# EAGLE design Croduino Nova (EAGLE 7.5.0)
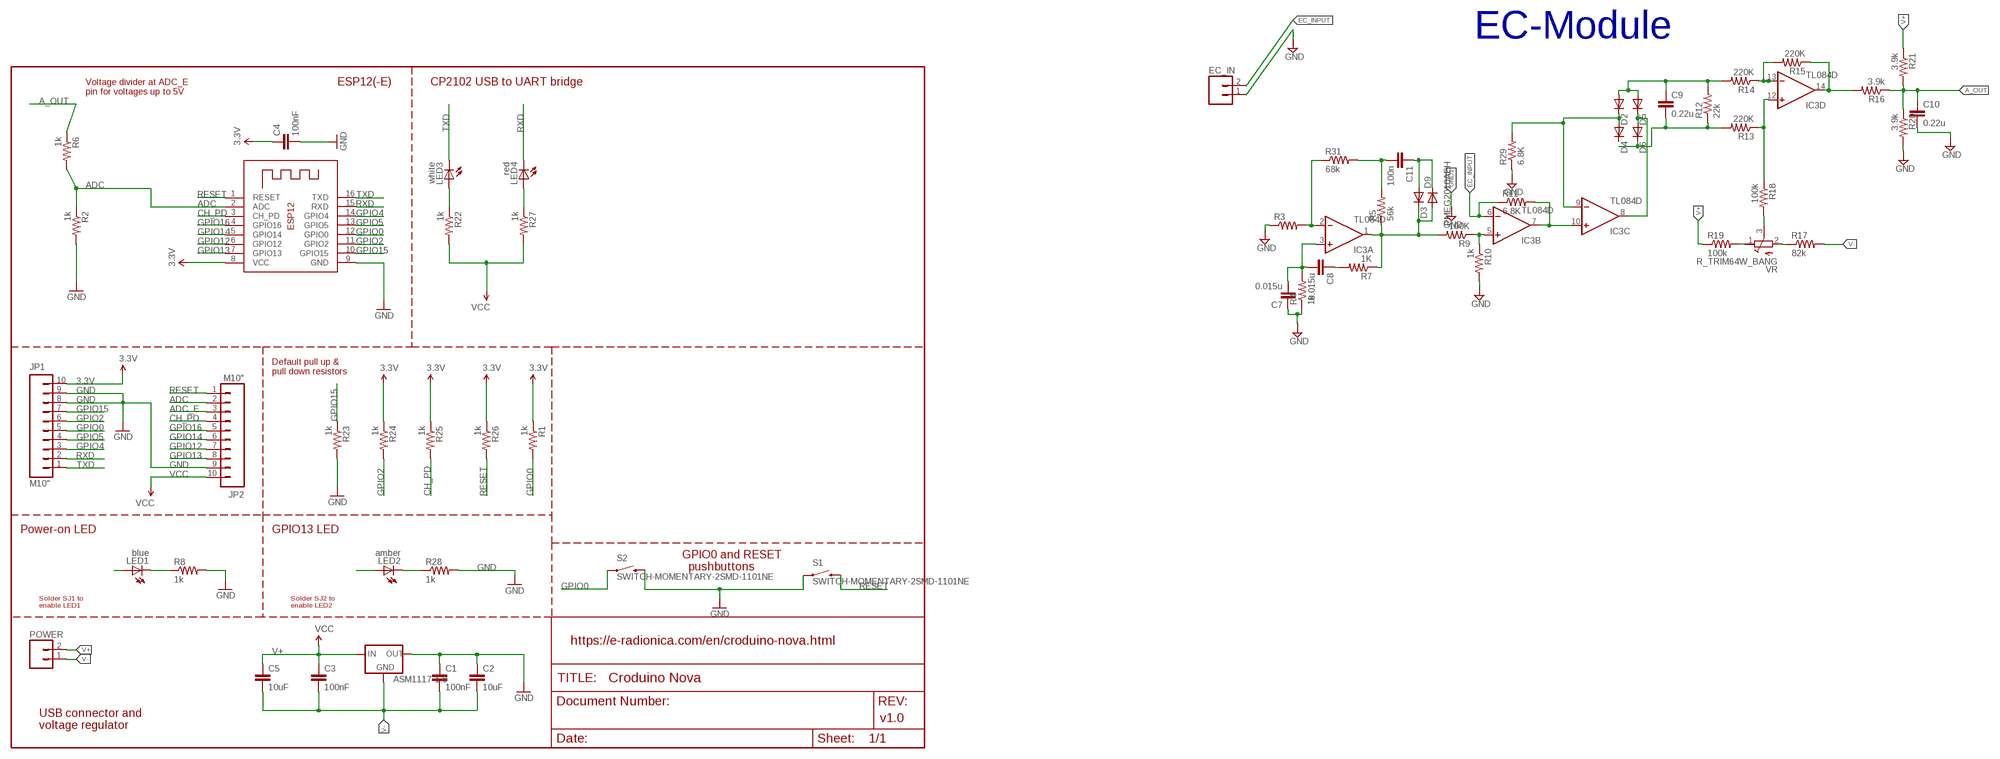
[diagram p0: schematic, sheet 1]

## Parts
ASM1117-1.8  AMS1117-3.3  [SOT223]
C1  100nF  CAP0603-CAP  [0603-CAP]
C2  10uF  CAP1206  [1206]
C3  100nF  CAP0603-CAP  [0603-CAP]
C4  100nF  CAP0603-CAP  [0603-CAP]
C5  10uF  CAP1206  [1206]
C7  0.015u  C-EUC0603  [C0603]
C8  0.015u  C-EUC0603  [C0603]
C9  0.22u  C-EUC0603  [C0603]
C10  0.22u  C-EUC0603  [C0603]
C11  100n  C-EUC0603  [C0603]
D2  PMEG2010AEH  DIOD_SOT123F  [SOT123F]
D3  PMEG2010AEH  DIOD_SOT123F  [SOT123F]
D4  PMEG2010AEH  DIOD_SOT123F  [SOT123F]
D5  PMEG2010AEH  DIOD_SOT123F  [SOT123F]
D6  PMEG2010AEH  DIOD_SOT123F  [SOT123F]
D9  PMEG2010AEH  DIOD_SOT123F  [SOT123F]
EC_IN  M025MM  [SCREWTERMINAL-5MM-2]
IC3  TL084D  [SO14]
JP1  M10"  [1X10]
JP2  M10"  [1X10]
LED1  blue  LEDCHIP-LED0603  [CHIP-LED0603]
LED2  amber  LEDCHIPLED_0603  [CHIPLED_0603]
LED3  white  LEDCHIP-LED0805  [CHIP-LED0805]
LED4  red  LEDCHIP-LED0805  [CHIP-LED0805]
POWER  M02LOCK_LONGPADS  [1X02_LOCK_LONGPADS]
R1  1k  R-US_R0603  [R0603]
R2  1k  R-US_R0603  [R0603]
R3  R-US_R0603  [R0603]
R4  1k  R-US_R0603  [R0603]
R5  56k  R-US_R0603  [R0603]
R6  1k  R-US_R0603  [R0603]
R7  1K  R-US_R0603  [R0603]
R8  1k  R-US_R0603  [R0603]
R9  100K  R-US_R0603  [R0603]
R10  1k  R-US_R0603  [R0603]
R11  6.8K  R-US_R0603  [R0603]
R12  22k  R-US_R0603  [R0603]
R13  220K  R-US_R0603  [R0603]
R14  220K  R-US_R0603  [R0603]
R15  220K  R-US_R0603  [R0603]
R16  3.9k  R-US_R0603  [R0603]
R17  82k  R-US_R0603  [R0603]
R18  100k  R-US_R0603  [R0603]
R19  100k  R-US_R0603  [R0603]
R20  3.9k  R-US_R0603  [R0603]
R21  3.9k  R-US_R0603  [R0603]
R22  1k  R-US_R0603  [R0603]
R23  1k  R-US_R0603  [R0603]
R24  1k  R-US_R0603  [R0603]
R25  1k  R-US_R0603  [R0603]
R26  1k  R-US_R0603  [R0603]
R27  1k  R-US_R0603  [R0603]
R28  1k  R-US_R0603  [R0603]
R29  6.8K  R-US_R0603  [R0603]
R31  68k  R-US_R0603  [R0603]
S1  SWITCH-MOMENTARY-2SMD-1101NE  [TACTILE-SWITCH-1101NE]
S2  SWITCH-MOMENTARY-2SMD-1101NE  [TACTILE-SWITCH-1101NE]
VR  R_TRIM64W_BANG  [RTRIM64W_BANG]
X1  ESP8266-12  ESP-12  [ESP-12]

## Nets
3.3V: C4.1 JP1.10 LED1.A R1.1 R24.1 R25.1 R26.1 X1.8(VCC)
A_OUT: C10.1 R6.1 R16.1 R20.1 R21.2
ADC: JP2.2 R2.1 R6.2 X1.2(ADC)
ADC_E: JP2.3
CH_PD: JP2.4 R25.2 X1.3(CH_PD)
EC_INPUT: EC_IN.2 IC3.6(B:-IN) R11.1
GND: ASM1117-1.8.4(OUT) C1.1 C2.1 C4.2 C7.1 C10.2 EC_IN.1 JP1.8 JP1.9 JP2.9 R2.2 R3.1 R4.1 R8.2 R10.2 R23.2 R28.2 R29.1 S1.1 S2.2 X1.9(GND)
GND1: R20.2 ; supply symbol labelled GND
GPIO0: JP1.5 R1.2 S2.1 X1.12(GPIO0)
GPIO2: JP1.6 R24.2 X1.11(GPIO2)
GPIO4: JP1.3 X1.14(GPIO4)
GPIO5: JP1.4 X1.13(GPIO5)
GPIO12: JP2.7 X1.6(GPIO12)
GPIO13: JP2.8 LED2.A X1.7(GPIO13)
GPIO14: JP2.6 X1.5(GPIO14)
GPIO15: JP1.7 R23.1 X1.10(GPIO15)
GPIO16: JP2.5 X1.4(GPIO16)
N$1: LED3.A R22.1
N$3: LED1.C R8.1
N$4: LED4.A R27.1
N$5: IC3.2(A:-IN) R3.2 R31.1
N$7: LED2.C R28.1
N$9: C7.2 C8.2 IC3.3(A:+IN) R4.2
N$10: C11.2 R5.2 R31.2
N$12: D3.C D9.A IC3.1(A:OUT) R5.1 R7.1 R9.2
N$13: C8.1 R7.2
N$14: IC3.5(B:+IN) R9.1 R10.1
N$15: IC3.7(B:OUT) IC3.10(C:+IN) R11.2
N$16: C9.1 D2.A D5.A R12.2 R14.2
N$17: D2.C D4.A IC3.9(C:-IN) R29.2
N$18: C9.2 D6.C R12.1 R13.2
N$19: D5.C D6.A IC3.8(C:OUT)
N$20: IC3.13(D:-IN) R14.1 R15.2
N$21: IC3.12(D:+IN) R13.1 R18.1
N$22: IC3.14(D:OUT) R15.1 R16.2
N$23: C11.1 D3.A D9.C
N$24: R17.1 VR.2(E)
N$25: R19.2 VR.1(A)
N$26: R18.2 VR.3(S)
RESET: JP2.1 R26.2 S1.2 X1.1(RESET)
RXD: JP1.2 LED4.C X1.15(RXD)
TXD: JP1.1 LED3.C X1.16(TXD)
V+: ASM1117-1.8.3(IN) C3.1 C5.1 POWER.2 R19.1 R21.1 ; supply symbol labelled VCC
V-: ASM1117-1.8.1(ADJ) C1.2 C2.2 C3.2 C5.2 POWER.1 R17.2
VCC: JP2.10 R22.2 R27.2
Unconnected: D4.C

## Notes on the sheet
- EC-Module
- ESP12(-E) | CP2102 USB to UART bridge
- Voltage divider at ADC_E
  pin for voltages up to 5V
- Default pull up &
  pull down resistors
- Power-on LED | GPIO13 LED
- GPIO0 and RESET
    pushbuttons
- Solder SJ1 to 
  enable LED1
- Solder SJ2 to
  enable LED2
- https://e-radionica.com/en/croduino-nova.html
- v1.0
- USB connector and 
  voltage regulator

## Power pins joined to a net without a drawn wire
V+: IC3.4(P:V+)
V-: IC3.11(P:V-)

## Library data of the parts
ASM1117-1.8 = SparkFun:AMS1117-3.3
C1-C5 = SparkFun:CAP: Capacitor Standard 0603 ceramic capacitor, and 0.1" leaded capacitor.
C7-C11 = resistor:C-EU: CAPACITOR, European symbol
D2-D6 D9 = Enleka_Diode:DIOD_SOT123F; PARTNO: PMEG2010AEH,115
EC_IN = SparkFun-Connectors:M02: Standard 2-pin 0.1" header. Use with - straight break away headers ( PRT-00116) - right angle break away headers (PRT-00553) - swiss pins (PRT-00743) - machine pins (PRT-00117) - female headers (PRT-00115) Molex polarized connector foot print use with: PRT-08233 with associated crimp pins and housings. 2.54_SCREWTERM for use with PRT-10571. 3.5mm Screw Terminal footprints for PRT-08084 5mm Screw Terminal footprints for use with PRT-08432; STOREFRONT_ID: PRT-08432
IC3 = linear:TL084: OP AMP
JP1 JP2 = SparkFun:M10: Header 10 Standard 10-pin 0.1" header. Use with straight break away headers (SKU : PRT-00116), right angle break away headers (PRT-00553), swiss pins (PRT-00743), machine pins (PRT-00117), and female headers (PRT-00115).
LED1-LED4 = adafruit:LED: LED OSRAM: - CHIPLED LG R971, LG N971, LY N971, LG Q971, LY Q971, LO R971, LY R971 LH N974, LH R974 LS Q976, LO Q976, LY Q976 LO Q996 - Hyper CHIPLED LW Q18S LB Q993, LB Q99A, LB R99A - SideLED LS A670, LO A670, LY A670, LG A670, LP A670 LB A673, LV A673, LT A673, LW A673 LH A674 LY A675 LS A676, LA A676, LO A676, LY A676, LW A676 LS A679, LY A679, LG A679 - Hyper Micro SIDELED® LS Y876, LA Y876, LO Y876, LY Y876 LT Y87S - SmartLED LW L88C, LW L88S LB L89C, LB L89S, LG L890 LS L89K, LO L89K, LY L89K LS L896, LA L896, LO L896, LY L896 - TOPLED LS T670, LO T670, LY T670, LG T670, LP T670 LSG T670, LSP T670, LSY T670, LOP T670, LYG T670 LG T671, LOG T671, LSG T671 LB T673, LV T673, LT T673, LW T673 LH T674 LS T676, LA T676, LO T676, LY T676, LB T676, LH T676, LSB T676, LW T676 LB T67C, LV T67C, LT T67C, LS T67K, LO T67K, LY T67K, LW E67C LS E67B, LA E67B, LO E67B, LY E67B, LB E67C, LV E67C, LT E67C LW T67C LS T679, LY T679, LG T679 LS T770, LO T770, LY T770, LG T770, LP T770 LB T773, LV T773, LT T773, LW T773 LH T774 LS E675, LA E675, LY E675, LS T675 LS T776, LA T776, LO T776, LY T776, LB T776 LHGB T686 LT T68C, LB T68C - Hyper Mini TOPLED® LB M676 - Mini TOPLED Santana® LG M470 LS M47K, LO M47K, LY M47K Source: http://www.osram.convergy.de/
POWER = SparkFun-Connectors:M02: Standard 2-pin 0.1" header. Use with - straight break away headers ( PRT-00116) - right angle break away headers (PRT-00553) - swiss pins (PRT-00743) - machine pins (PRT-00117) - female headers (PRT-00115) Molex polarized connector foot print use with: PRT-08233 with associated crimp pins and housings. 2.54_SCREWTERM for use with PRT-10571. 3.5mm Screw Terminal footprints for PRT-08084 5mm Screw Terminal footprints for use with PRT-08432
R1-R29 R31 = resistor:R-US_: RESISTOR, American symbol
S1 S2 = SparkFun-Electromechanical:SWITCH-MOMENTARY-2: Various NO switches- pushbuttons, reed, etc; PROD_ID: SWCH-00815
VR = rtrim:R_TRIM64W_BANG
X1 = adafruit:ESP-12

## Net classes
0 default: width 0.178 mm, drill 0.381 mm, clearance 0.178 mm

## Board
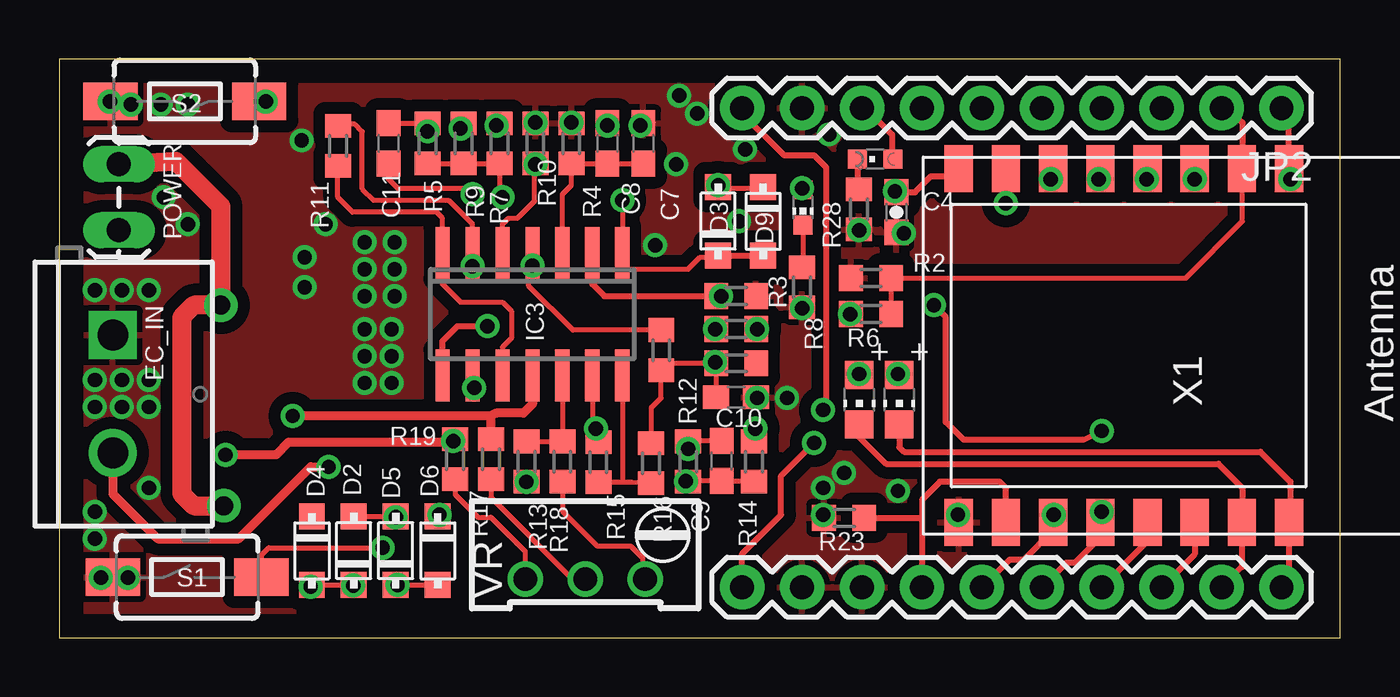
[diagram p1: board, top side]
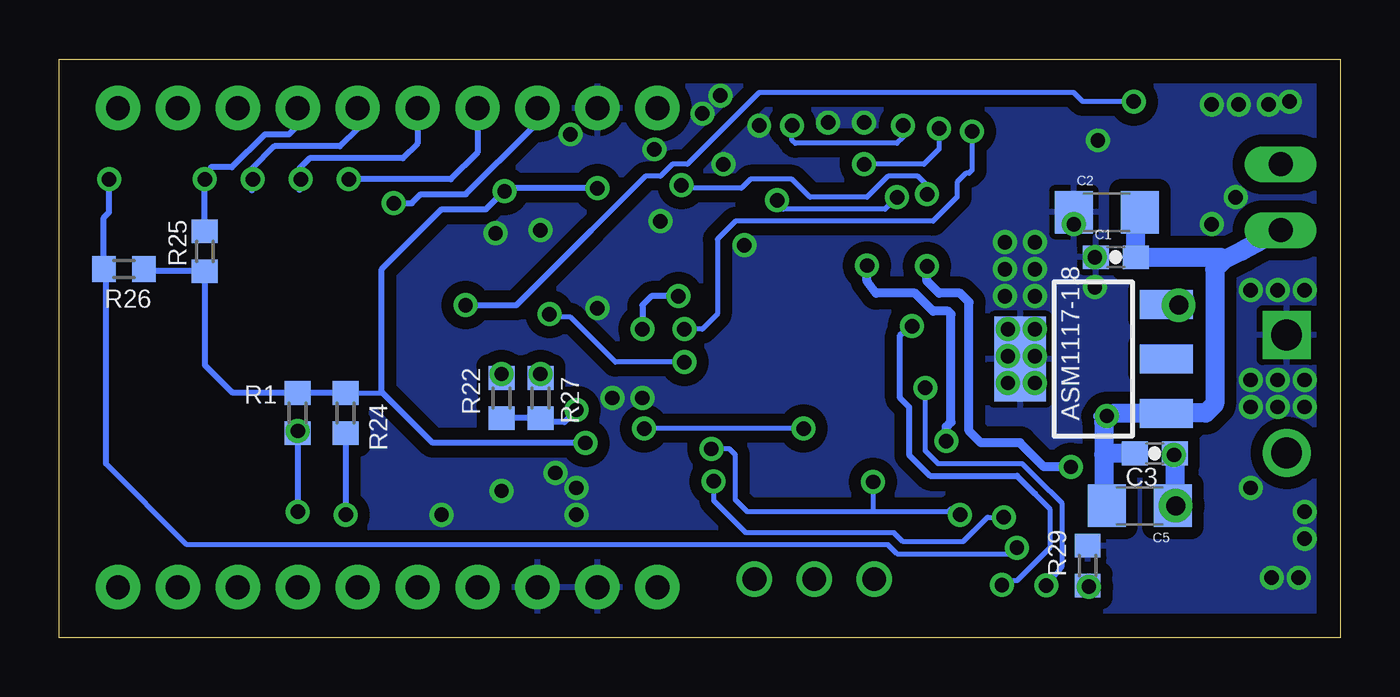
[diagram p2: board, bottom side, seen from below]

Size 54.32 x 24.54 mm. Coordinates in mm from the lower left corner, seen from the top.
Outline: 0,0 54.32,0 54.32,24.54 0,24.54 0,0
Copper layers (1*16): Top 0.035mm / dielectric 1.5mm / Bottom 0.035mm
Design rules "default *": minimum track width 8mil, minimum drill 24mil, track to track 10mil, track to pad 10mil, pad to pad 10mil, via to via 1mil, smd to smd 8mil, copper to edge 40mil, drill to drill 8mil, minimum pad ring 10mil, minimum via ring 8mil, stop-mask expansion 4mil, vias tented up to drill 5mm, thermal gap 10mil

### Footprints (pad centres in the part's own frame; a part is rotated, then mirrored left to right if it is on the bottom)
SOT223 = smd 1.219 x 2.235: 1 -2.311,-3.099; 2 0,-3.099; 3 2.311,-3.099 | smd 3.6 x 2.2: 4 0,3.099
0603-CAP = smd 1.1 x 1: 1 -0.85,0; 2 0.85,0
1206 = smd 1.6 x 1.8: 1 -1.4,0; 2 1.4,0
C0603 = smd 1.1 x 1: 1 -0.85,0; 2 0.85,0
SOT123F = smd 1.1 x 1.1: A 1.45,0; C -1.45,0
SCREWTERMINAL-5MM-2 = drill 1.3 pad 2.032 square: 1 0,0 | drill 1.3 pad 2.032: 2 5,0
SO14 = smd 0.6 x 2.2: 1 -3.81,-2.6; 2 -2.54,-2.6; 3 -1.27,-2.6; 4 0,-2.6; 5 1.27,-2.6; 6 2.54,-2.6; 7 3.81,-2.6; 8 3.81,2.6; 9 2.54,2.6; 10 1.27,2.6; 11 0,2.6; 12 -1.27,2.6; 13 -2.54,2.6; 14 -3.81,2.6
1X10 = drill 1.016 pad 1.88: 1 0,0; 2 2.54,0; 3 5.08,0; 4 7.62,0; 5 10.16,0; 6 12.7,0; 7 15.24,0; 8 17.78,0; 9 20.32,0; 10 22.86,0
CHIP-LED0603 = smd 0.8 x 0.8: A 0,-0.75; C 0,0.75
CHIPLED_0603 = smd 0.8 x 0.8: A 0,-0.75; C 0,0.75
CHIP-LED0805 = smd 1.2 x 1.2: A 0,-1.05; C 0,1.05
1X02_LOCK_LONGPADS = drill 1.016 long: 1 -0.127,0; 2 2.667,0
R0603 = smd 1 x 1.1: 1 -0.85,0; 2 0.85,0
TACTILE-SWITCH-1101NE = smd 2.3 x 1.6: 1 -3.15,0; 2 3.15,0
RTRIM64W_BANG = drill 1: 1 2.54,-2.54; 2 2.54,0; 3 2.54,2.54
ESP-12 = smd 2 x 1.2: 1 -7.5,4.5; 2 -7.5,2.5; 3 -7.5,0.5; 4 -7.5,-1.5; 5 -7.5,-3.5; 6 -7.5,-5.5; 7 -7.5,-7.5; 8 -7.5,-9.5; 9 7.5,-9.5; 10 7.5,-7.5; 11 7.5,-5.5; 12 7.5,-3.5; 13 7.5,-1.5; 14 7.5,0.5; 15 7.5,2.5; 16 7.5,4.5

### Placement (x,y rotation side)
ASM1117-1.8  10.48,11.81 90 bottom
C1  9.52,16.13 0 bottom
C2  9.91,18.03 0 bottom
C3  7.87,7.81 180 bottom
C4  35.5,18.03 270 top
C5  8.51,5.59 180 bottom
C7  24.77,20.96 270 top
C8  23.24,20.96 270 top
C9  28.09,7.49 90 top
C10  28.7,10.19 0 top
C11  13.97,20.96 90 top
D2  12.5,3.68 90 top
D3  27.94,17.65 90 top
D4  10.72,3.68 270 top
D5  14.27,3.68 90 top
D6  16.05,3.68 270 top
D9  29.84,17.65 270 top
EC_IN  2.29,12.83 270 top
IC3  20.07,13.72 180 top
JP1  51.82,2.13 180 top
JP2  51.82,22.46 180 top
LED1  31.53,18.24 180 top
LED2  34.59,20.29 90 top
LED3  35.61,10.09 180 top
LED4  33.92,10.09 180 top
POWER  2.54,17.4 90 top
R1  44.2,9.53 270 bottom
R2  34.42,15.24 180 top
R3  28.7,14.48 180 top
R4  21.72,20.96 270 top
R5  15.62,20.96 90 top
R6  34.42,13.72 0 top
R7  18.67,20.96 90 top
R8  31.5,14.86 270 top
R9  17.14,20.96 270 top
R10  20.19,20.96 90 top
R11  11.84,20.85 270 top
R12  26.67,7.47 270 top
R13  19.81,7.47 270 top
R14  29.46,7.47 270 top
R15  22.86,7.44 90 top
R16  25.1,7.39 270 top
R17  18.31,7.57 90 top
R18  21.34,7.47 270 top
R19  16.79,7.57 270 top
R20  28.7,11.63 0 top
R21  25.53,12.19 270 top
R22  35.56,10.16 270 bottom
R23  33.27,5.08 180 top
R24  42.16,9.53 270 bottom
R25  48.13,16.38 90 bottom
R26  51.56,15.62 180 bottom
R27  33.91,10.16 270 bottom
R28  33.91,18.16 270 top
R29  10.72,3.05 270 bottom
R31  28.7,13.08 180 top
S1  5.44,2.57 0 top
S2  5.33,22.73 180 top
U$2  [CRODUINO_NOVA]  4.32,0.64 0 top
U$3  [NOVI_LOGO-4MM]  25.74,14.76 0 top
U$4  [OSH3MM]  20.22,3.87 0 top
VR  22.3,5.03 270 top
X1  47.64,12.38 270 top

### Tracks (layer width: path | path; a pad name or v marks a point on that pad's centre or on a via)
3.3V  (via drill 0.61)
  Top 0.203: 37.9,19.65 X1.8
  Top 0.254: X1.8 37.81,19.56 36.96,19.56 36.28,18.88 C4.1 35.33,18.92 v35.43,18.92 | LED1.A 31.69,18.99 v31.5,19.05 | JP1.10 28.96,3.56 30.61,5.21 30.61,6.86 v32,8.26
  Bottom 0.203: R24.1 40.68,10.38 40.64,10.41
  Bottom 0.254: v31.5,19.05 35.05,19.05 v35.43,18.92 35.47,18.88 C4.1 36.22,18.16 38.1,18.16 40.64,15.62 40.64,10.41 38.48,8.26 v32,8.26 | R24.1 R1.1 46.95,10.38 48.13,11.56 R25.1 50.5,15.53 R26.1
A_OUT  (via drill 0.61)
  Top 0.203: R20.1 C10.1 | R16.1 25.09,9.73 25.53,10.16 R21.2 25.82,11.63 R20.1 | R20.1 28.14,11.63 v27.81,11.68 | v33.53,13.72 R6.1
  Bottom 0.203: v27.81,11.68 30.73,11.68 32.64,13.59 33.15,13.59 v33.53,13.72
ADC
  Top 0.203: R6.2 R2.1 47.75,15.24 50.16,17.65 50.16,19.85 X1.2
  Top 0.254: JP2.2 49.55,22.46 50.16,21.84 50.16,19.91 X1.2
CH_PD  (via drill 0.61)
  Top 0.254: v48.13,19.43 48.01,19.75 X1.3
  Bottom 0.254: R25.2 v48.13,19.43 47.88,19.94 46.99,19.94 45.59,21.34 44.58,21.34 44.2,21.71 JP2.4
EC_INPUT  (via drill 0.61)
  Top 0.203: 17.53,16.57 17.53,17.53 16.51,18.54 13.33,18.54 12.85,19.03 12.85,21.46 12.55,21.77 11.9,21.77 R11.1
  Top 0.381: EC_IN.2 2.29,6.1 4.19,4.19 7.62,4.19 10.67,7.24 v11.43,7.24 | v17.53,15.75 IC3.6 17.53,16.57
  Bottom 0.381: v11.43,7.24 12.57,7.24 13.59,8.26 15.24,8.26 15.75,8.76 15.75,14.22 16.13,14.61 17.02,14.61 17.53,15.11 v17.53,15.75
GND  (via drill 0.61)
  Top 0.203: R4.1 22.06,21.81 v21.72,21.84 | v24.64,21.72 25.19,21.84 C7.1
  Bottom 0.203: 24.51,21.84 v24.64,21.72
  other vias: 32.38,5.21 29.59,10.16 30.86,10.16 35.81,17.15 32.38,6.35 33.27,6.98 33.91,17.27 1.78,2.54 2.92,2.54 1.52,4.19 1.52,5.33 1.52,10.92 2.67,10.92 3.81,10.92 3.81,9.78 2.67,9.78 1.52,9.78 2.16,22.73 3.05,22.61 26.29,22.99 27.05,22.23 29.08,20.7 32.64,21.34 20.19,21.84 26.16,20.07 10.41,16.13 10.41,14.86 11.3,17.53 12.95,13.08 14.1,13.08 14.1,11.94 12.95,11.94 4.44,18.67 5.46,17.53 38.1,5.21 25.27,16.64 12.95,14.48 14.22,14.48 12.95,15.62 14.22,15.62 12.95,16.76 14.22,16.76 3.81,6.35 10.29,21.08 35.56,6.22 4.32,22.61 5.46,22.61 1.52,14.73 2.67,14.73 3.81,14.73 31.5,13.97 28.83,17.65 12.95,10.79 14.1,10.79
  pour Top (isolate 0.508): 0.13,0.64 54.31,0.64 54.31,24.12 0.13,24.12
  pour Bottom (isolate 0.508): 0.13,0.51 54.31,0.64 54.31,24.12 0.13,24.12
GPIO0  (via drill 0.61)
  Top 0.203: S2.1 v8.76,22.73
  Top 0.254: v44.2,5.33 44.2,4.94 X1.12 44.14,4.26 43.05,3.17 42.7,3.17 JP1.5 | v44.2,8.76 43.43,8.38 38.35,8.38 37.59,9.14 37.59,13.59 v37.08,14.1
  Bottom 0.203: v8.76,22.73 10.92,22.73 11.3,23.11 24.64,23.11 27.69,20.07 28.32,20.07 28.83,19.56 29.46,19.56 31.75,17.27
  Bottom 0.254: v44.2,5.33 R1.2 v44.2,8.76 | v37.08,14.1 34.92,14.1 31.75,17.27
GPIO2  (via drill 0.61)
  Top 0.254: v42.16,5.21 42.16,4.91 X1.11 42.14,4.54 40.89,3.3 40.28,3.3 JP1.6
  Bottom 0.254: R24.2 v42.16,5.21
GPIO4
  Top 0.254: X1.14 48.14,3.53 JP1.3
GPIO5
  Top 0.254: X1.13 46.14,4.07 JP1.4
GPIO12  (via drill 0.61)
  Top 0.254: v42.04,19.43 41.94,19.69 X1.6
  Bottom 0.254: JP2.7 36.58,20.57 37.72,19.43 v42.04,19.43
GPIO13  (via drill 0.61)
  Top 0.254: JP2.8 34.19,22.46 35.31,21.34 35.31,20.32 LED2.A | X1.7 v40.14,18.42 v40.13,18.42
  Bottom 0.254: v40.13,18.42 39.37,18.42 38.99,18.8 37.08,18.8 34.29,21.59 34.29,22.2 JP2.8
GPIO14  (via drill 0.61)
  Top 0.254: v44.07,19.43 44.07,19.82 X1.5
  Bottom 0.254: JP2.6 39.12,20.95 39.75,20.32 43.7,20.32 X1.5 44.14,18.99 v44.07,19.43
GPIO15
  Top 0.254: R23.1 36.58,5.08 | 36.58,5.08 JP1.7 | X1.10 40.14,6.35 39.88,6.6 37.34,6.6 36.58,5.84 36.58,5.08
GPIO16  (via drill 0.61)
  Top 0.254: v46.1,19.43 46.1,19.85 X1.4
  Bottom 0.254: JP2.5 41.66,21.59 42.42,20.83 45.19,20.83 X1.4 46.14,18.96 v46.1,19.43
N$1  (via drill 0.61)
  Top 0.203: LED3.A 35.36,11.61 v35.56,11.18
  Bottom 0.203: v35.56,11.18 35.69,11.14 R22.1
N$3
  Top 0.203: LED1.C 31.53,15.74 R8.1
N$4  (via drill 0.61)
  Top 0.203: LED4.A 33.8,11.16 v33.91,11.18
  Bottom 0.203: v33.91,11.18 R27.1
N$5  (via drill 0.61)
  Top 0.254: IC3.2 22.61,14.99 23.11,14.48 R3.2 v28.07,14.48 | v29.59,13.08 29.46,12.99 R31.1
  Bottom 0.254: v28.07,14.48 29.21,14.48 29.59,14.1 v29.59,13.08
N$7
  Top 0.254: LED2.C 33.84,19.07 R28.1
N$9
  Top 0.203: IC3.3 21.34,18.8 21.72,19.18 R4.2 C8.2 C7.2
N$10  (via drill 0.61)
  Top 0.203: C11.2 R5.2 v15.62,21.46 | v27.81,13.08 R31.2
  Bottom 0.203: v15.62,21.46 15.62,19.81 15.75,19.69 15.88,19.69 16.26,19.3 16.26,18.67 17.27,17.65 25.65,17.65 26.42,16.89 26.42,13.72 27.05,13.08 v27.81,13.08
N$12  (via drill 0.61)
  Top 0.203: R5.1 R9.2 R7.1 18.67,18.92 v18.8,18.67 | v23.88,18.54 IC3.1 23.88,15.75 24,15.62 26.67,15.62 27.18,16.13 27.87,16.13 D3.C
  Top 0.254: 27.83,16.32 D3.C D9.A
  Bottom 0.203: v18.8,18.67 19.3,18.16 23.62,18.16 v23.88,18.54
N$13  (via drill 0.61)
  Top 0.203: R7.2 18.63,21.81 v18.54,21.72 | v23.24,21.72 C8.1
  Bottom 0.203: v18.54,21.72 18.54,21.21 18.8,20.96 23.11,20.96 23.24,21.08 v23.24,21.72
N$14  (via drill 0.61)
  Top 0.203: IC3.5 18.8,17.53 19.05,17.78 19.43,17.78 20.17,18.52 20.17,20.08 R10.1 | R9.1 17.14,21.72 v17.02,21.59 | 20.19,19.94 20.61,20.19 R10.1 | v20.19,20.07 20.15,20.07 R10.1
  Bottom 0.203: v17.02,21.59 17.02,20.7 17.65,20.07 v20.19,20.07
N$15
  Top 0.203: 18.85,11.17 IC3.10 18.8,12.32 19.18,12.7 19.18,13.84 18.8,14.22 17.02,14.22 16.26,14.99 IC3.7 16.26,17.78 16,18.03 12.45,18.03 11.81,18.67 11.81,19.98 R11.2
N$16  (via drill 0.61)
  Top 0.203: R14.2 29.44,6.64 C9.1 26.7,6.64 R12.2 26.58,6.62 v26.57,6.63 | v14.28,5.1 14.3,5.1 D5.A D2.A
  Bottom 0.203: v26.57,6.63 26.57,5.82 25.2,4.45 18.92,4.45 18.54,4.06 16,4.06 14.96,5.1 v14.28,5.1
N$17  (via drill 0.61)
  Top 0.203: D2.C 12.5,2.31 v12.47,2.21 | v17.6,10.59 17.63,11.01 IC3.9 | v10.67,2.16 10.67,2.18 D4.A 12.45,2.23 v12.47,2.21 | 12.24,1.98 v12.47,2.21
  Bottom 0.203: v17.6,10.59 17.6,7.92 17.04,7.37 13.49,7.37 12.34,6.22 12.32,6.22 11.81,5.71 11.81,3 v12.47,2.21 | R29.2 10.72,2.21 v10.67,2.16
N$18  (via drill 0.61)
  Top 0.203: C9.2 26.7,8.34 R12.1 v26.67,8 | D6.C 16.05,5.38 v16.13,5.21 | R13.2 v19.81,6.6
  Bottom 0.203: v16.13,5.21 16.51,5.46 16.64,5.33 19.81,5.33 | 19.81,5.33 25.15,5.33 25.65,5.84 25.65,7.75 25.91,8 v26.67,8 | v19.81,6.6 19.81,5.33
N$19  (via drill 0.61)
  Top 0.203: D6.A v14.35,2.23 D5.C
  Top 0.254: IC3.8 16.26,12.57 16.89,13.21 v18.16,13.21
  Bottom 0.203: 12.95,6.1 12.32,5.46 12.32,3.81 13.72,2.41 14.3,2.41 v14.35,2.23
  Bottom 0.254: 12.95,6.1 13.72,6.86 17.4,6.86 18.29,7.75 18.29,9.78 18.67,10.16 18.67,12.83 v18.16,13.21
N$20  (via drill 0.61)
  Top 0.203: IC3.13 22.61,8.55 R15.2 23.05,8.29 23.11,8.36 v22.76,8.87 | v29.52,8.87 29.42,8.36 R14.1
  Bottom 0.203: v22.76,8.87 v29.52,8.87
N$21
  Top 0.203: IC3.12 R18.1 R13.1
N$22
  Top 0.203: R15.1 23.93,6.59 | 23.93,6.59 24.28,6.59 R16.2 | IC3.14 23.88,6.64 23.93,6.59
N$23  (via drill 0.61)
  Top 0.203: C11.1 13.97,19.43 14.35,19.05 17.27,19.05 v17.53,18.8 | v27.94,19.18 28.12,19.05 | 28.12,19.05 D3.A | 28.12,19.05 29.79,19.05 D9.C
  Bottom 0.203: v27.94,19.18 27.69,19.05 25.4,19.05 25.02,19.43 23.24,19.43 22.48,18.67 20.07,18.67 19.18,19.56 17.91,19.56 17.53,19.18 v17.53,18.8
N$24
  Top 0.203: VR.2 22.23,2.56 21.69,2.56 18.31,5.94 R17.1
N$25
  Top 0.203: R19.2 16.79,6.07 17.75,5.1 18.31,5.1 19.76,3.66 VR.1
N$26
  Top 0.203: R18.2 21.34,5.36 22.81,3.89 24.23,3.89 24.74,3.38 24.74,2.59 VR.3
RESET  (via drill 0.61)
  Top 0.203: S1.2 8.59,3.51 8.89,3.81 v13.72,3.81
  Top 0.254: JP2.1 52.14,22.14 X1.1 52.2,19.82 v52.2,19.43
  Bottom 0.203: 52.32,7.37 48.89,3.94 19.18,3.94 18.8,3.56 13.97,3.56 v13.72,3.81
  Bottom 0.254: 52.2,22.08 JP2.1 | 52.32,7.37 52.32,15.66 R26.2 52.41,17.82 52.2,18.03 v52.2,19.43
RXD
  Top 0.254: LED4.C 33.92,8.5 35.05,7.37 49.15,7.37 50.16,6.35 50.16,4.91 X1.15 50.14,2.99 JP1.2
TXD
  Top 0.254: LED3.C 35.61,8.07 35.81,7.87 50.93,7.87 52.2,6.6 52.2,4.94 X1.16 52.14,2.45 JP1.1
V+  (via drill 0.61, 0.81 pad 1.42)
  Top 0.203: R21.1 21.78,13.04 19.91,14.91 19.91,15.62 v20.07,15.77
  Top 0.381: v7.06,7.75 9.2,7.75 9.74,8.29 16.55,8.29 v16.71,8.33 16.79,8.53 R19.1 | v20.07,15.77 20.17,16.21 IC3.4
  Top 0.813: v6.98,5.59 5.71,5.59 5.21,6.1 5.21,13.59 5.71,14.1 v6.86,14.1 6.86,18.29 4.95,20.19 POWER.2
  Bottom 0.381: v7.06,7.75 7.09,7.75 C3.1 | v20.07,15.77 20.07,15.11 19.69,14.61 18.03,14.61 17.27,13.84 16.64,13.84 16.51,13.72 16.51,9.14 16.71,8.94 v16.71,8.33
  Bottom 0.813: ASM1117-1.8.3 6.88,14.12 v6.86,14.1 6.6,14.35 | C5.1 v6.98,5.59 7.02,5.63 C3.1
V-  (via drill 0.61)
  Top 0.203: 18.34,8.45 R17.2
  Top 0.381: IC3.11 20.07,9.91 19.69,9.53 18.54,9.53 18.29,9.4 | 18.29,9.4 18.29,8.45 R17.2 | 18.29,9.4 v9.91,9.4
  Bottom 0.381: v9.91,9.4 10.29,9.4 10.03,9.14
  Bottom 0.813: POWER.1 4.19,16.38 4.95,16 | 4.95,16 5.33,15.62 5.33,9.91 5.71,9.53 7.36,9.53 ASM1117-1.8.1 9.68,9.5 10.03,9.14 10.03,7.75 | C2.2 8.68,17.87 C1.2 5.08,16.13 4.95,16 | 10.03,7.75 10.03,5.71 C5.2 | C3.2 9.97,7.81 10.03,7.75
VCC  (via drill 0.61)
  Top 0.254: JP2.10 28.96,22.22 30.73,20.45 32,20.45 32.51,19.94 32.51,9.78 v32.38,9.65
  Bottom 0.254: R22.2 R27.2 33.74,9.14 32.89,9.14 v32.38,9.65

### Text on the board
200bmp: pwr | tx | rx | 5V | gnd | #13 | #12 | #14 | #16 | EN | A_e | A | rst | -- | -- | -- | RESET | rev v1.1 | Croduino Nova / e-radionica.com / Apr 2016 | * | v1.1., REV A | GPIO0 | ESP12-E | -- | 3V3 | gnd | gnd | #15 | #2 | #0 | #5 | #4 | rx | tx | #13 LED